# Altium schematic sheet alimentation.SchDoc
size A4; DrawnBy: WATTEU; SheetNumber: 3; SheetTotal: 3
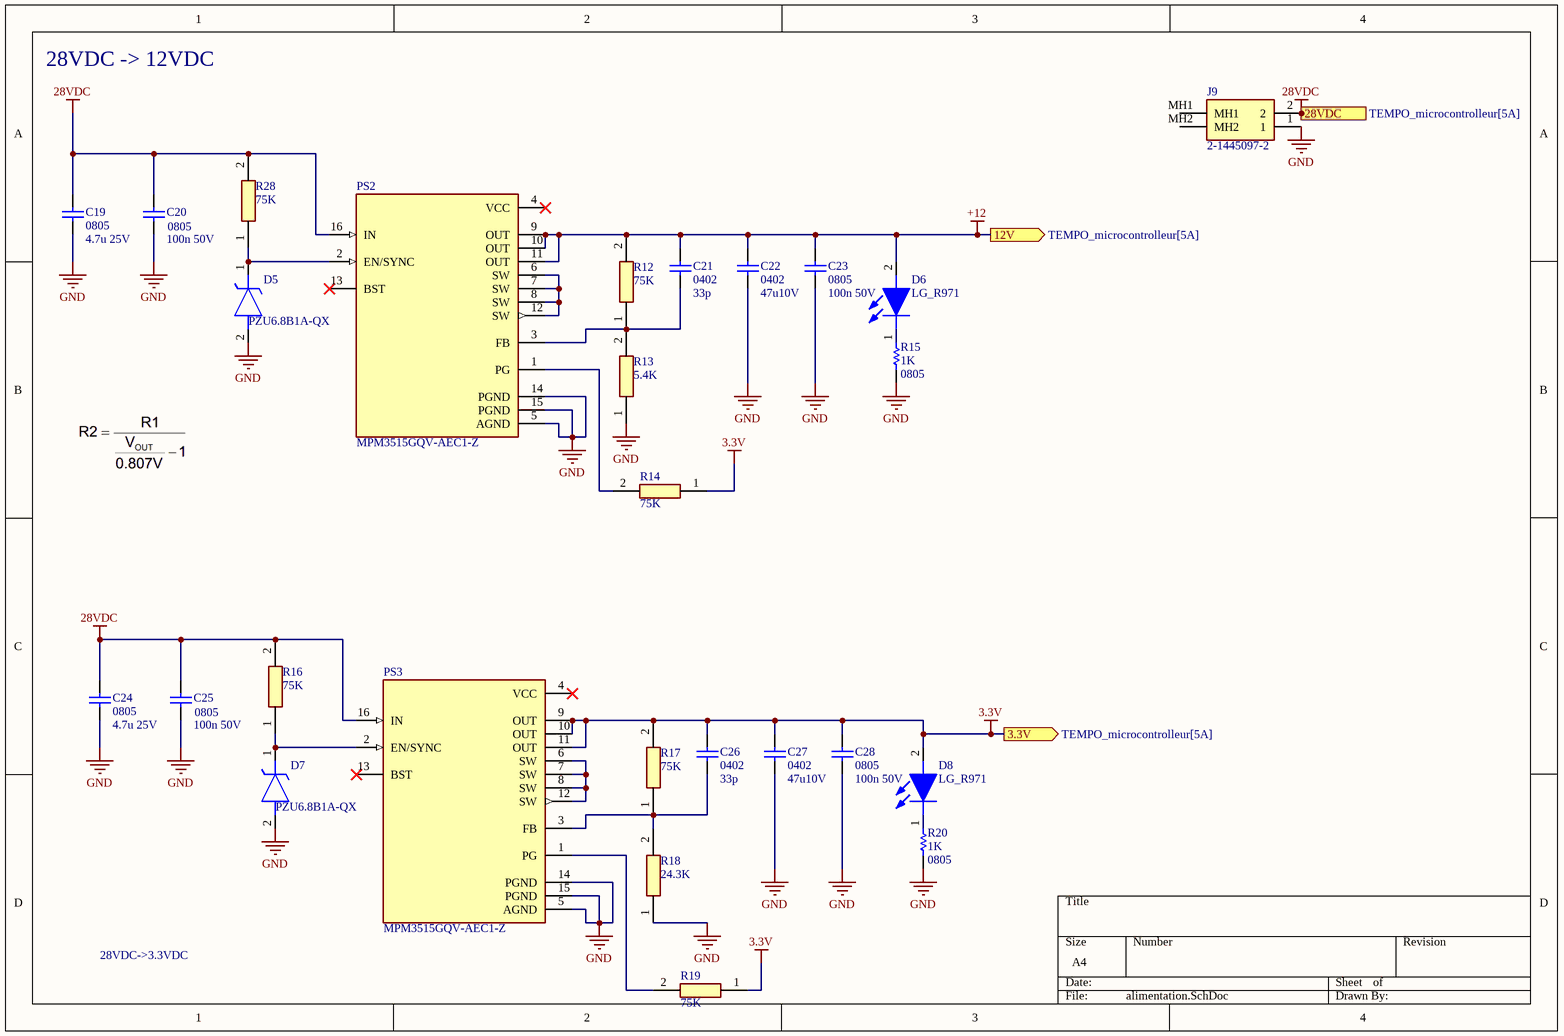
[diagram p0: alimentation.SchDoc]

## Parts
C19  value 4.7u 25V  Type: 0805  [CONDENSATEUR_CMS_0805]  (hidden comment: CMS_0805)
C20  value 100n 50V  Type: 0805  [CONDENSATEUR_CMS_0805]  (hidden comment: CMS_0805)
C21  value 33p  Type: 0402  [CONDENSATEUR_CMS_0402]  (hidden comment: CMS_0402)
C22  value 47u10V  Type: 0402  [CONDENSATEUR_CMS_0402]  (hidden comment: CMS_0402)
C23  value 100n 50V  Type: 0805  [CONDENSATEUR_CMS_0402]  (hidden comment: CMS_0402)
C24  value 4.7u 25V  Type: 0805  [CONDENSATEUR_CMS_0805]  (hidden comment: CMS_0805)
C25  value 100n 50V  Type: 0805  [CONDENSATEUR_CMS_0805]  (hidden comment: CMS_0805)
C26  value 33p  Type: 0402  [CONDENSATEUR_CMS_0402]  (hidden comment: CMS_0402)
C27  value 47u10V  Type: 0402  [CONDENSATEUR_CMS_0402]  (hidden comment: CMS_0402)
C28  value 100n 50V  Type: 0805  [CONDENSATEUR_CMS_0402]  (hidden comment: CMS_0402)
D5  PZU6.8B1A-QX  [PZU68B1AQX]
D6  LG_R971  [LEDC2012X90N]
D7  PZU6.8B1A-QX  [PZU68B1AQX]
D8  LG_R971  [LEDC2012X90N]
J9  2-1445097-2  [214450972]
PS2  MPM3515GQV-AEC1-Z  [CONV_MPM3515GQV-AEC1-Z]
PS3  MPM3515GQV-AEC1-Z  [CONV_MPM3515GQV-AEC1-Z]
R12  75K  [RESC1005X40N]
R13  5.4K  [RESC1005X40N]
R14  75K  [RESC1005X40N]
R15  value 1K  Type: 0805  [RESISTANCE_CMS_0603]  (hidden comment: RESISTANCE_CMS_0603)
R16  75K  [RESC1005X40N]
R17  75K  [RESC1005X40N]
R18  24.3K  [RESC1005X40N]
R19  75K  [RESC1005X40N]
R20  value 1K  Type: 0805  [RESISTANCE_CMS_0603]  (hidden comment: RESISTANCE_CMS_0603)
R28  75K  [RESC1005X40N]

## Ports
3.3V (out, see TEMPO_microcontrolleur[5A]), 12V (out, see TEMPO_microcontrolleur[5A]), 28VDC (out, see TEMPO_microcontrolleur[5A])

## Nets
3.3V: C26.1 C27.1 C28.1 D8.2(A) PS3.9(OUT) PS3.10(OUT) PS3.11(OUT) R14.1 R17.2 R19.1 ; port 3.3V
28VDC: C19.2 C20.2 C24.2 C25.2 J9.2 PS2.16(IN) PS3.16(IN) R16.2 R28.2 ; port 28VDC
+12: C21.1 C22.1 C23.1 D6.2(A) PS2.9(OUT) PS2.10(OUT) PS2.11(OUT) R12.2 ; port 12V
GND: C19.1 C20.1 C22.2 C23.2 C24.1 C25.1 C27.2 C28.2 D5.2(A) D7.2(A) J9.1 PS2.5(AGND) PS2.14(PGND) PS2.15(PGND) PS3.5(AGND) PS3.14(PGND) PS3.15(PGND) R13.1 R15.1 R18.1 R20.1
NetC21_2: C21.2 PS2.3(FB) R12.1 R13.2
NetC26_2: C26.2 PS3.3(FB) R17.1 R18.2
NetD5_1: D5.1(K) PS2.2(EN/SYNC) R28.1
NetD6_1: D6.1(K) R15.2
NetD7_1: D7.1(K) PS3.2(EN/SYNC) R16.1
NetD8_1: D8.1(K) R20.2
NetPS2_1: PS2.1(PG) R14.2
NetPS2_6: PS2.6(SW) PS2.7(SW) PS2.8(SW) PS2.12(SW)
NetPS3_1: PS3.1(PG) R19.2
NetPS3_6: PS3.6(SW) PS3.7(SW) PS3.8(SW) PS3.12(SW)

Not connected (* = marked no-connect by the designer): J9 MH1 MH2; PS2 4(VCC)* 13(BST)*; PS3 4(VCC)* 13(BST)*

## Notes on the sheet
- 28VDC -> 12VDC
- 28VDC->3.3VDC

## Library data of the parts
C19 C20 C24 C25 = CONDENSATEUR_CMS_CER_0805: CONDENSATEUR CMS CERAMIQUE 0805
C21-C23 C26-C28 = CONDENSATEUR_CMS_CER_0402: CONDENSATEUR CMS CERAMIQUE 0402
D5 D7 = PZU6.8B1A-QX: Zener Diode; Manufacturer_Name: Nexperia; Datasheet Link: https://assets.nexperia.com/documents/data-sheet/PZUXBA-Q_SER.pdf; Height: 1.1mm; Manufacturer_Part_Number: PZU6.8B1A-QX
D6 D8 = LG_R971: Green 570nm LED Indication - Discrete 2.2V 0805 (2012 Metric); MF: OSRAM Opto; MP: LG R971; Package: 0805 Osram Opto; Price: None; Value: *; SnapEDA_Link: https://www.snapeda.com/parts/LG%20R971/OSRAM+Opto+Semiconductors+Inc./view-part/?ref=snap; Availability: In Stock; Check_prices: https://www.snapeda.com/parts/LG%20R971/OSRAM+Opto+Semiconductors+Inc./view-part/?ref=eda
J9 = 2-1445097-2: MICRO MNL HDR ASSY S/ROW AU LF; Manufacturer_Name: TE Connectivity; Geometry.Height: 5.8mm; Mouser Part Number: 571-2-1445097-2; Mouser Price/Stock: https://www.mouser.co.uk/ProductDetail/TE-Connectivity-AMP/2-1445097-2?qs=WeHYKPpr%2FZjBFQqBJ1Kj7A%3D%3D; Manufacturer_Part_Number: 2-1445097-2; Datasheet Link: https://www.te.com/commerce/DocumentDelivery/DDEController?Action=showdoc&DocId=Customer+Drawing%7F1445097%7FA2%7Fpdf%7FEnglish%7FENG_CD_1445097_A2.pdf%7F2-1445097-2
PS2 PS3 = MPM3515GQV-AEC1-Z: Non-Isolated PoL Module DC DC Converter 1 Output 0.8 ~ 30V 1.5A 4V - 36V Input; MF: Monolithic Power; MP: MPM3515GQV-AEC1-Z; DigiKey-Purchase-URL: https://snapeda.com/shop?store=DigiKey&id=1050597; Availability: Unavailable; SnapEDA_Link: https://www.snapeda.com/parts/MPM3515GQV-AEC1-Z/Monolithic%20Power%20Systems%20Inc./view-part/1050597/?ref=snap; Package: QFN-17 Monolithic Power Systems; Price: None; Value: *
R12-R14 R16-R19 R28 = CRCW04020000Z0ED: Resistor; Manufacturer_Name: Vishay; Allied_Number: 70202079; Datasheet Link: http://uk.rs-online.com/web/p/products/2508364793; Height: 0.4mm; RS Part Number: 2508364793; RS Price/Stock: http://uk.rs-online.com/web/p/products/2508364793; Manufacturer_Part_Number: CRCW04020000Z0ED
R15 R20 = RESISTANCE_CMS_0603: RESISTANCE CMS 0603